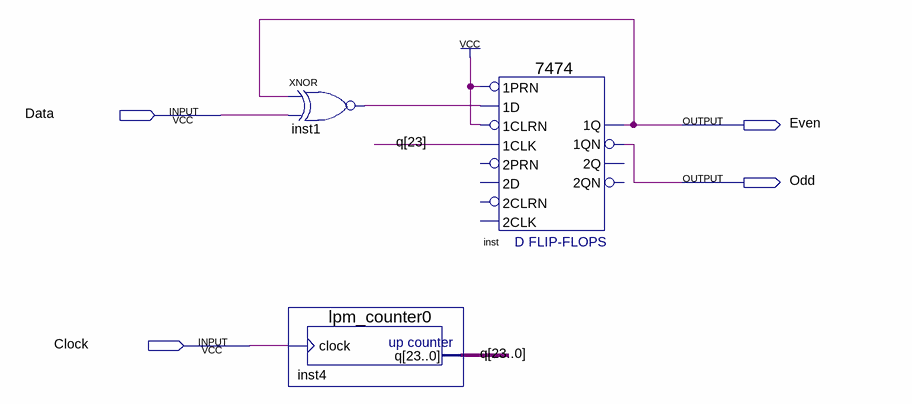
[diagram p0: schematic sheet]
// Quartus schematic final4.bdf as structural Verilog: 3 symbols, 4 pins
module final4 (
  input  Data,
  input  Clock,
  output Even,
  output Odd
);

  wire inst1_out;
  wire [23:0] q;

  xnor inst1 (inst1_out, Even, Data);
  lpm_counter0 inst4 (.clock(Clock), .q(q));
  \7474  inst (
    .\1CLK (q[23]), .\1D (inst1_out), .\1PRN (1'b1), .\1CLRN (1'b1), .\1QN (Odd), .\1Q (Even));  // open: 2D, 2PRN, 2CLK, 2CLRN, 2Q, 2QN
endmodule
